# Altium schematic sheet WiFi_SCH.SchDoc
size A
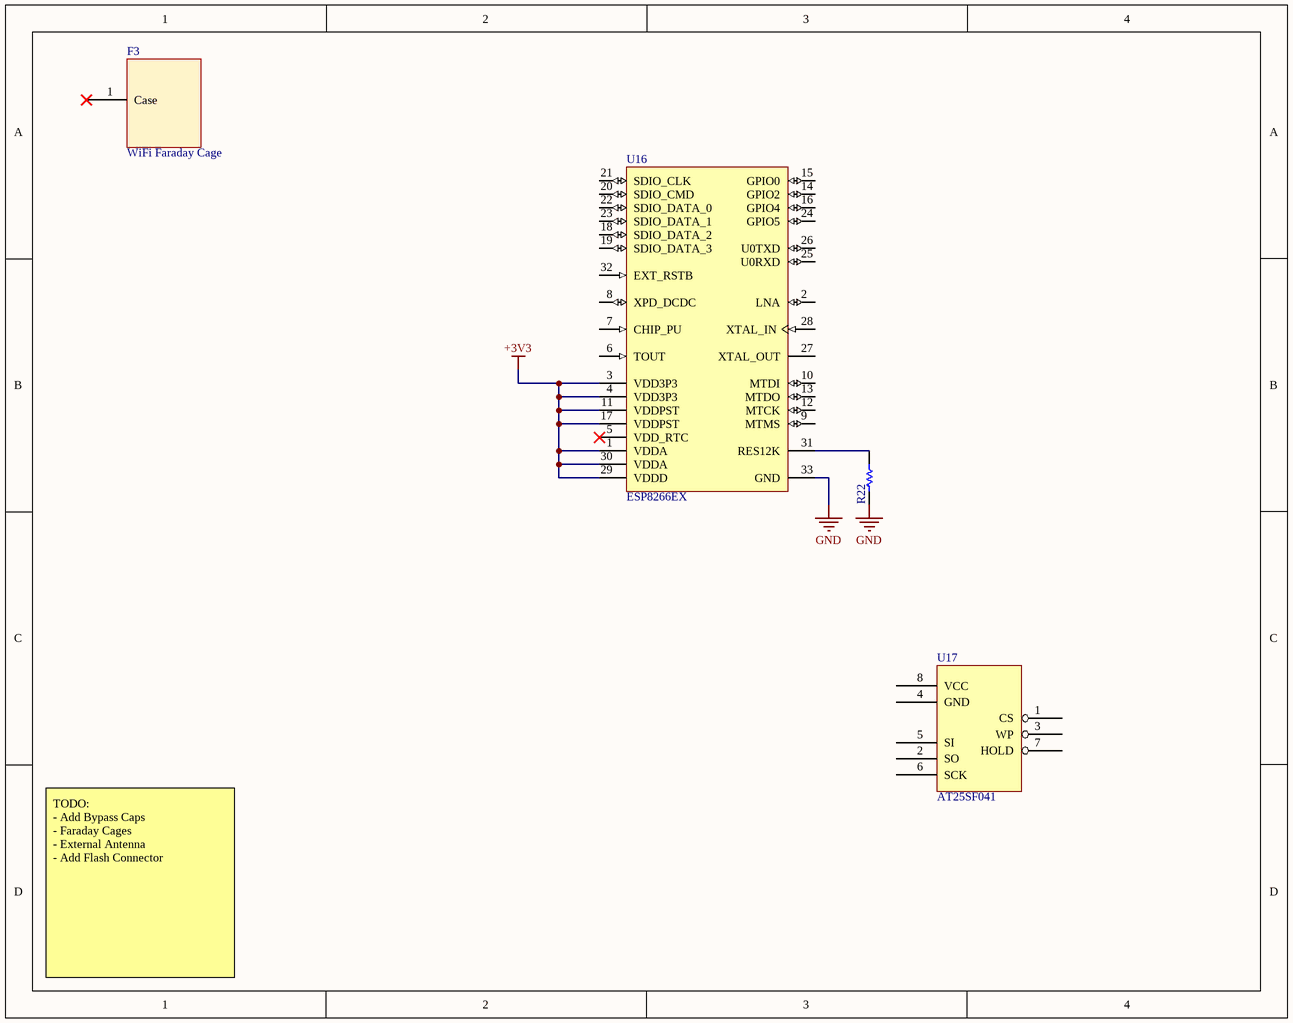
[diagram p0: WiFi_SCH.SchDoc]

## Parts
F3  WiFi Faraday Cage
R22  RES-2  [RES 0402]  (value not drawn)
U16  ESP8266EX  [ESFS-QFN-32_L]
U17  AT25SF041  [SOIC127P600X175-8N]

## Nets
+3V3: U16.1(VDDA) U16.3(VDD3P3) U16.4(VDD3P3) U16.11(VDDPST) U16.17(VDDPST) U16.29(VDDD) U16.30(VDDA)
GND: R22.1 U16.33(GND)
NetR22_2: R22.2 U16.31(RES12K)

Not connected (* = marked no-connect by the designer): F3 1(Case)*; U16 2(LNA) 5(VDD_RTC)* 6(TOUT) 7(CHIP_PU) 8(XPD_DCDC) 9(MTMS) 10(MTDI) 12(MTCK) 13(MTDO) 14(GPIO2) 15(GPIO0) 16(GPIO4) 18(SDIO_DATA_2) 19(SDIO_DATA_3) 20(SDIO_CMD) 21(SDIO_CLK) 22(SDIO_DATA_0) 23(SDIO_DATA_1) 24(GPIO5) 25(U0RXD) 26(U0TXD) 27(XTAL_OUT) 28(XTAL_IN) 32(EXT_RSTB); U17 1(CS) 2(SO) 3(WP) 4(GND) 5(SI) 6(SCK) 7(HOLD) 8(VCC)

## Notes on the sheet
- TODO:
  - Add Bypass Caps
  - Faraday Cages
  - External Antenna
  - Add Flash Connector

## Library data of the parts
F3 = FARADAY_CAGE
R22 = RES: Value: 12k; Tolerance: 1%
U16 = CMP-2000-07453-1: Low-Power, Highly-Integrated Wi-Fi Solution, 2.5 to 3.6 V, 80 mA, -40 to 125 degC, 32-Pin QFN; Manufacturer: Espressif Systems; Mounting Technology: SurfaceMount; Datasheet URL: http://espressif.com/sites/default/files/documentation/0a-esp8266ex_datasheet_en.pdf; Package Reference: QFN-32; Package Description: 32-Pin Quad Falt No-Lead, Body 5 x 5 mm, Pitch 0.5 mm; Manufacturer URL: http://espressif.com; Datasheet Version: Rev. 5.4, 04/2017
U17 = AT25SF041: IC FLASH 4M SPI 104MHZ 8SOIC; ComponentLink1Description: DigiKey; ComponentLink1URL: https://www.digikey.com/product-detail/en/adesto-technologies/AT25SF041-SSHD-T/1265-1131-1-ND/